# Altium schematic sheet LED_Driver_and_LEDs_04.SchDoc
size A
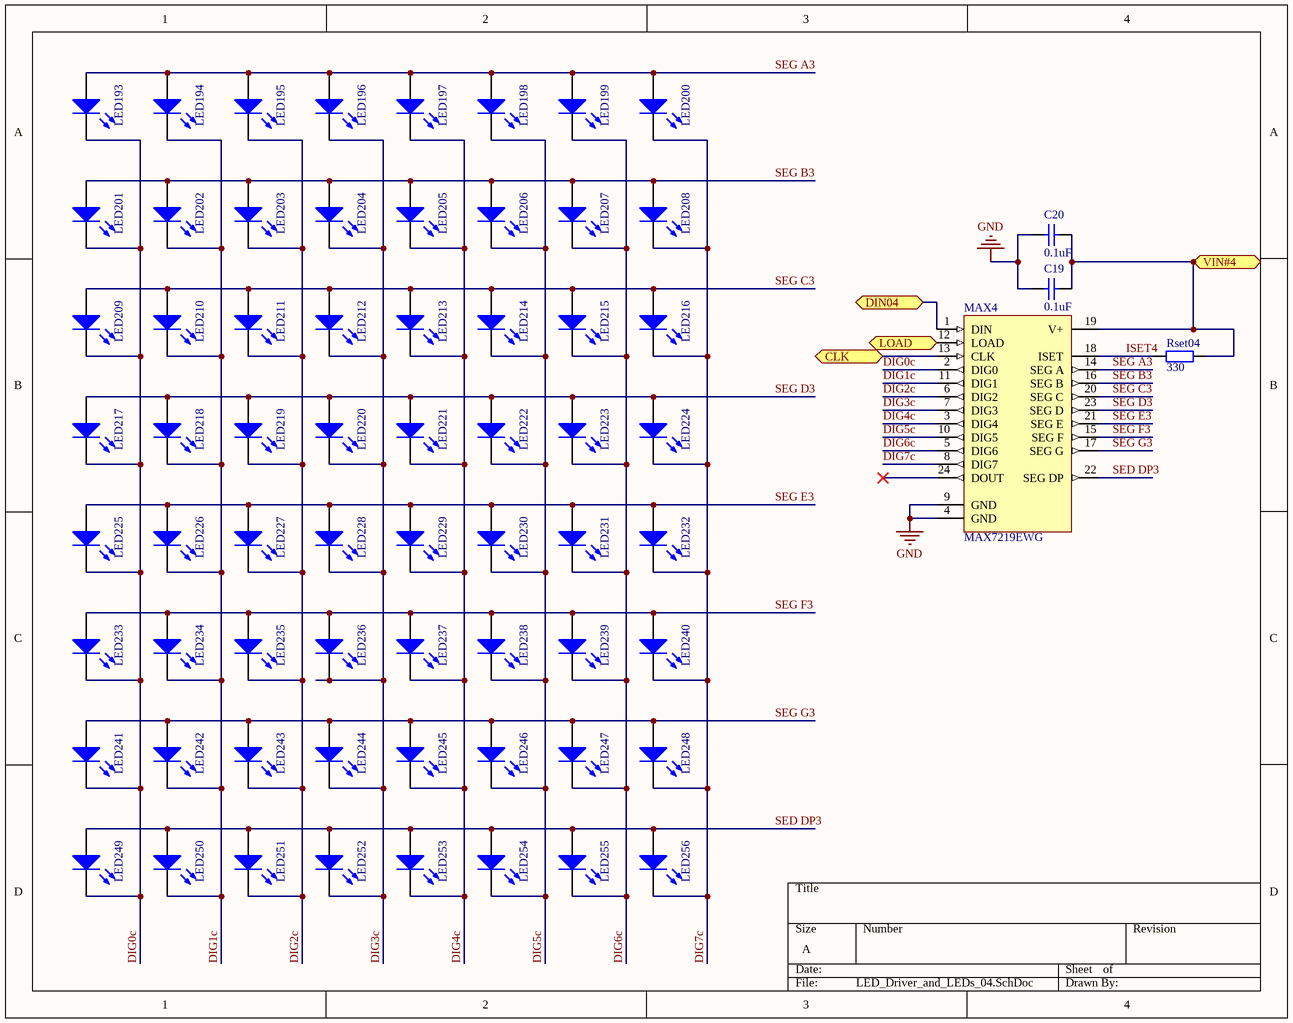
[diagram p0: LED_Driver_and_LEDs_04.SchDoc]

## Parts
C19  value 0.1uF  [6-0805_N]  (hidden comment: Cap Semi)
C20  value 0.1uF  [6-0805_N]  (hidden comment: Cap Semi)
LED193  LED3  [3.5X2.8X1.9]  (value not drawn)
LED194  LED3  [3.5X2.8X1.9]  (value not drawn)
LED195  LED3  [3.5X2.8X1.9]  (value not drawn)
LED196  LED3  [3.5X2.8X1.9]  (value not drawn)
LED197  LED3  [3.5X2.8X1.9]  (value not drawn)
LED198  LED3  [3.5X2.8X1.9]  (value not drawn)
LED199  LED3  [3.5X2.8X1.9]  (value not drawn)
LED200  LED3  [3.5X2.8X1.9]  (value not drawn)
LED201  LED3  [3.5X2.8X1.9]  (value not drawn)
LED202  LED3  [3.5X2.8X1.9]  (value not drawn)
LED203  LED3  [3.5X2.8X1.9]  (value not drawn)
LED204  LED3  [3.5X2.8X1.9]  (value not drawn)
LED205  LED3  [3.5X2.8X1.9]  (value not drawn)
LED206  LED3  [3.5X2.8X1.9]  (value not drawn)
LED207  LED3  [3.5X2.8X1.9]  (value not drawn)
LED208  LED3  [3.5X2.8X1.9]  (value not drawn)
LED209  LED3  [3.5X2.8X1.9]  (value not drawn)
LED210  LED3  [3.5X2.8X1.9]  (value not drawn)
LED211  LED3  [3.5X2.8X1.9]  (value not drawn)
LED212  LED3  [3.5X2.8X1.9]  (value not drawn)
LED213  LED3  [3.5X2.8X1.9]  (value not drawn)
LED214  LED3  [3.5X2.8X1.9]  (value not drawn)
LED215  LED3  [3.5X2.8X1.9]  (value not drawn)
LED216  LED3  [3.5X2.8X1.9]  (value not drawn)
LED217  LED3  [3.5X2.8X1.9]  (value not drawn)
LED218  LED3  [3.5X2.8X1.9]  (value not drawn)
LED219  LED3  [3.5X2.8X1.9]  (value not drawn)
LED220  LED3  [3.5X2.8X1.9]  (value not drawn)
LED221  LED3  [3.5X2.8X1.9]  (value not drawn)
LED222  LED3  [3.5X2.8X1.9]  (value not drawn)
LED223  LED3  [3.5X2.8X1.9]  (value not drawn)
LED224  LED3  [3.5X2.8X1.9]  (value not drawn)
LED225  LED3  [3.5X2.8X1.9]  (value not drawn)
LED226  LED3  [3.5X2.8X1.9]  (value not drawn)
LED227  LED3  [3.5X2.8X1.9]  (value not drawn)
LED228  LED3  [3.5X2.8X1.9]  (value not drawn)
LED229  LED3  [3.5X2.8X1.9]  (value not drawn)
LED230  LED3  [3.5X2.8X1.9]  (value not drawn)
LED231  LED3  [3.5X2.8X1.9]  (value not drawn)
LED232  LED3  [3.5X2.8X1.9]  (value not drawn)
LED233  LED3  [3.5X2.8X1.9]  (value not drawn)
LED234  LED3  [3.5X2.8X1.9]  (value not drawn)
LED235  LED3  [3.5X2.8X1.9]  (value not drawn)
LED236  LED3  [3.5X2.8X1.9]  (value not drawn)
LED237  LED3  [3.5X2.8X1.9]  (value not drawn)
LED238  LED3  [3.5X2.8X1.9]  (value not drawn)
LED239  LED3  [3.5X2.8X1.9]  (value not drawn)
LED240  LED3  [3.5X2.8X1.9]  (value not drawn)
LED241  LED3  [3.5X2.8X1.9]  (value not drawn)
LED242  LED3  [3.5X2.8X1.9]  (value not drawn)
LED243  LED3  [3.5X2.8X1.9]  (value not drawn)
LED244  LED3  [3.5X2.8X1.9]  (value not drawn)
LED245  LED3  [3.5X2.8X1.9]  (value not drawn)
LED246  LED3  [3.5X2.8X1.9]  (value not drawn)
LED247  LED3  [3.5X2.8X1.9]  (value not drawn)
LED248  LED3  [3.5X2.8X1.9]  (value not drawn)
LED249  LED3  [3.5X2.8X1.9]  (value not drawn)
LED250  LED3  [3.5X2.8X1.9]  (value not drawn)
LED251  LED3  [3.5X2.8X1.9]  (value not drawn)
LED252  LED3  [3.5X2.8X1.9]  (value not drawn)
LED253  LED3  [3.5X2.8X1.9]  (value not drawn)
LED254  LED3  [3.5X2.8X1.9]  (value not drawn)
LED255  LED3  [3.5X2.8X1.9]  (value not drawn)
LED256  LED3  [3.5X2.8X1.9]  (value not drawn)
MAX4  MAX7219EWG  [WSO24_N]
Rset04  value 330  [J1-0603]  (hidden comment: Res2)

## Ports
CLK (bidir), DIN04 (bidir), LOAD (bidir), VIN#4 (in)

## Nets
GND: C19.2 C20.2 MAX4.4(GND) MAX4.9(GND)
CLK: MAX4.13(CLK) ; port CLK
DIG0c: LED193.2(K) LED201.2(K) LED209.2(K) LED217.2(K) LED225.2(K) LED233.2(K) LED241.2(K) LED249.2(K) MAX4.2(DIG0)
DIG1c: LED194.2(K) LED202.2(K) LED210.2(K) LED218.2(K) LED226.2(K) LED234.2(K) LED242.2(K) LED250.2(K) MAX4.11(DIG1)
DIG2c: LED195.2(K) LED203.2(K) LED211.2(K) LED219.2(K) LED227.2(K) LED235.2(K) LED243.2(K) LED251.2(K) MAX4.6(DIG2)
DIG3c: LED196.2(K) LED204.2(K) LED212.2(K) LED220.2(K) LED228.2(K) LED236.2(K) LED244.2(K) LED252.2(K) MAX4.7(DIG3)
DIG4c: LED197.2(K) LED205.2(K) LED213.2(K) LED221.2(K) LED229.2(K) LED237.2(K) LED245.2(K) LED253.2(K) MAX4.3(DIG4)
DIG5c: LED198.2(K) LED206.2(K) LED214.2(K) LED222.2(K) LED230.2(K) LED238.2(K) LED246.2(K) LED254.2(K) MAX4.10(DIG5)
DIG6c: LED199.2(K) LED207.2(K) LED215.2(K) LED223.2(K) LED231.2(K) LED239.2(K) LED247.2(K) LED255.2(K) MAX4.5(DIG6)
DIG7c: LED200.2(K) LED208.2(K) LED216.2(K) LED224.2(K) LED232.2(K) LED240.2(K) LED248.2(K) LED256.2(K) MAX4.8(DIG7)
DIN04: MAX4.1(DIN) ; port DIN04
ISET4: MAX4.18(ISET) Rset04.2
LOAD: MAX4.12(LOAD) ; port LOAD
SED DP3: LED249.1(A) LED250.1(A) LED251.1(A) LED252.1(A) LED253.1(A) LED254.1(A) LED255.1(A) LED256.1(A) MAX4.22(SEG_DP)
SEG A3: LED193.1(A) LED194.1(A) LED195.1(A) LED196.1(A) LED197.1(A) LED198.1(A) LED199.1(A) LED200.1(A) MAX4.14(SEG_A)
SEG B3: LED201.1(A) LED202.1(A) LED203.1(A) LED204.1(A) LED205.1(A) LED206.1(A) LED207.1(A) LED208.1(A) MAX4.16(SEG_B)
SEG C3: LED209.1(A) LED210.1(A) LED211.1(A) LED212.1(A) LED213.1(A) LED214.1(A) LED215.1(A) LED216.1(A) MAX4.20(SEG_C)
SEG D3: LED217.1(A) LED218.1(A) LED219.1(A) LED220.1(A) LED221.1(A) LED222.1(A) LED223.1(A) LED224.1(A) MAX4.23(SEG_D)
SEG E3: LED225.1(A) LED226.1(A) LED227.1(A) LED228.1(A) LED229.1(A) LED230.1(A) LED231.1(A) LED232.1(A) MAX4.21(SEG_E)
SEG F3: LED233.1(A) LED234.1(A) LED235.1(A) LED236.1(A) LED237.1(A) LED238.1(A) LED239.1(A) LED240.1(A) MAX4.15(SEG_F)
SEG G3: LED241.1(A) LED242.1(A) LED243.1(A) LED244.1(A) LED245.1(A) LED246.1(A) LED247.1(A) LED248.1(A) MAX4.17(SEG_G)
VIN#4: C19.1 C20.1 MAX4.19(V+) Rset04.1 ; port VIN#4

Not connected (* = marked no-connect by the designer): MAX4 24(DOUT)*

## Library data of the parts
C19 C20 = Cap Semi: Capacitor (Semiconductor SIM Model); Published: 8-Jun-2000; LatestRevisionDate: 29-May-2009; LatestRevisionNote: IPC-7351 Footprint Added.; PackageReference: C1206; Publisher: Altium Limited; PackageDescription: Chip Capacitor
LED193-LED256 = LED3: Typical BLUE SiC LED; Published: 8-Jun-2000; LatestRevisionDate: 17-Dec-2003; LatestRevisionNote: PCB Footprint replaced.; DatasheetVersion: 16-Apr-2002; PackageVersion: 16-Apr-2002; PackageReference: 3.5X2.8X1.9; Publisher: Altium Limited; PackageDescription: SM LED; 2 C-Bend Leads; Body 3.5 x 2.8 x 1.9 mm, inc leads (LxWxH typ)
MAX4 = MAX7219EWG: Serially Interfaced, 8-Digit LED Display Driver; Published: 16-Jan-2001; LatestRevisionDate: 13-Apr-2006; LatestRevisionNote: IPC-7351 Footprint Added.; DatasheetVersion: Jul-1997; PackageReference: WSO24; Publisher: Altium Limited; PackageDescription: 24-Pin Small Outline Integrated Circuit 1.27 mm Pitch; ComponentLink1Description: Manufacturer Link; ComponentLink1URL: http://www.maxim-ic.com/; ComponentLink2Description: Datasheet; ComponentLink2URL: http://pdfserv.maxim-ic.com/en/ds/MAX7219-MAX7221.pdf
Rset04 = Res2: Resistor; Published: 8-Jun-2000; LatestRevisionDate: 17-Jul-2002; LatestRevisionNote: Re-released for DXP Platform.; PackageReference: AXIAL-0.4; Publisher: Altium Limited; PackageDescription: Axial Device, Thru-Hole; 2 Leads; 0.4 in Pin Spacing